# EAGLE design blue-led-2 (EAGLE 9.6.2)
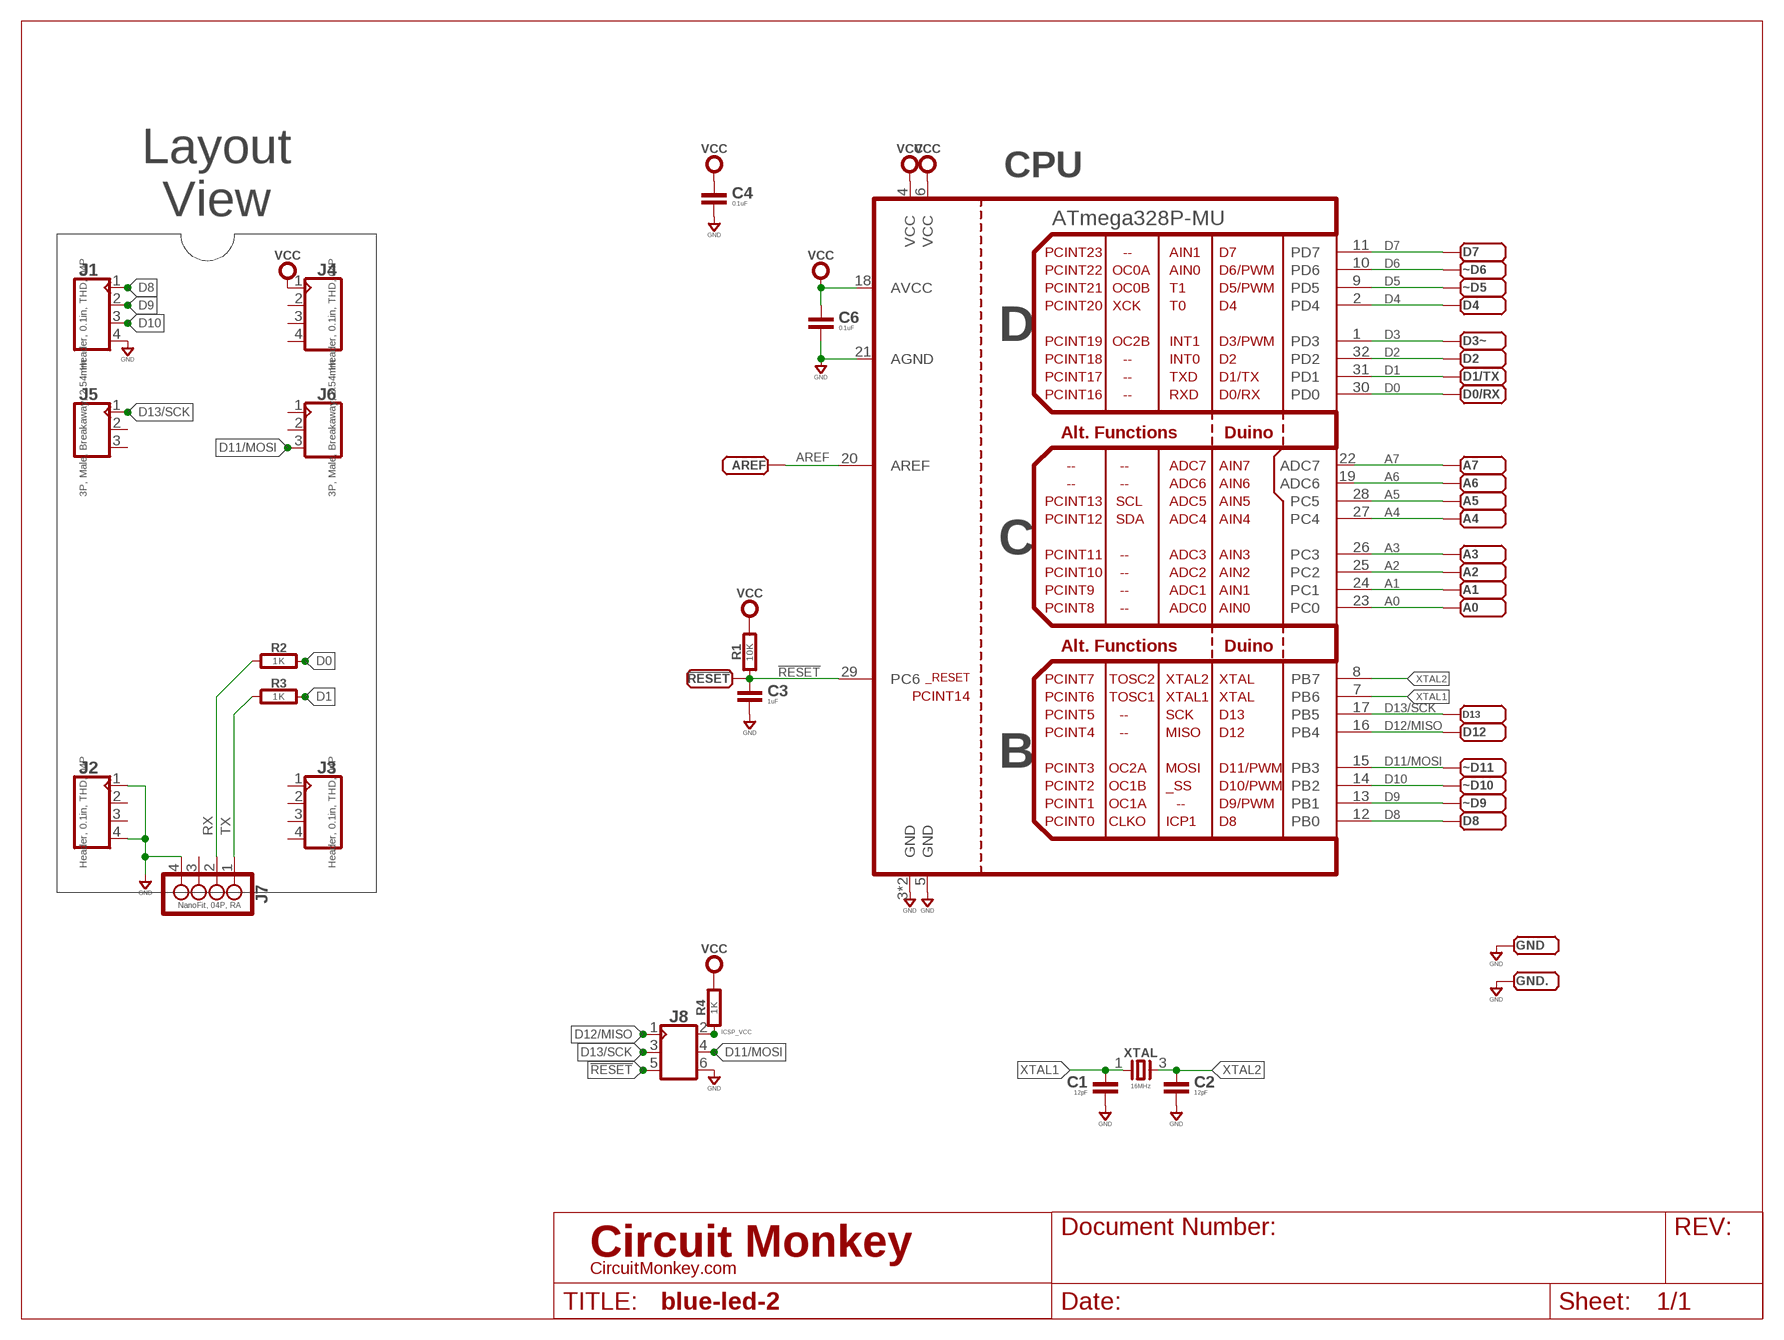
[diagram p0: schematic, sheet 1]

## Parts
!RESET  PADSMD-050X050  [SMD-050X050]
A0  PADSMD-050X050  [SMD-050X050]
A1  PADSMD-050X050  [SMD-050X050]
A2  PADSMD-050X050  [SMD-050X050]
A3  PADSMD-050X050  [SMD-050X050]
A4  PADSMD-050X050  [SMD-050X050]
A5  PADSMD-050X050  [SMD-050X050]
A6  PADSMD-050X050  [SMD-050X050]
A7  PADSMD-050X050  [SMD-050X050]
AREF  PADSMD-050X050  [SMD-050X050]
C1  12pF  CAPACITOR0603  [0603-CAP]
C2  12pF  CAPACITOR0603  [0603-CAP]
C3  1uF  CAPACITOR0603  [0603-CAP]
C4  0.1uF  CAPACITOR0603  [0603-CAP]
C6  0.1uF  CAPACITOR0603  [0603-CAP]
CPU  ATmega328P-MU  ATMEGA328MU  [MLF32]
D0/RX  PADSMD-050X050  [SMD-050X050]
D1/TX  PADSMD-050X050  [SMD-050X050]
D2  PADSMD-050X050  [SMD-050X050]
D3~  PADSMD-050X050  [SMD-050X050]
D4  PADSMD-050X050  [SMD-050X050]
D7  PADSMD-050X050  [SMD-050X050]
D8  PADSMD-050X050  [SMD-050X050]
D12  PADSMD-050X050  [SMD-050X050]
D13  PADSMD-050X050  [SMD-050X050]
GND  PADSMD-050X050  [SMD-050X050]
GND.  PADSMD-050X050  [SMD-050X050]
J1  Header, 0.1in, THD, 04P  CON_04X1-THD-VT  [MA04X1-VT-THD]
J2  Header, 0.1in, THD, 04P  CON_04X1-THD-VT  [MA04X1-VT-THD]
J3  Header, 0.1in, THD, 04P  CON_04X1-THD-VT  [MA04X1-VT-THD]
J4  Header, 0.1in, THD, 04P  CON_04X1-THD-VT  [MA04X1-VT-THD]
J5  3P, Male, Breakaway, 2.54mm  CON_03X1-2.54MM-THD-VT  [MA03X1-VT-THD]
J6  3P, Male, Breakaway, 2.54mm  CON_03X1-2.54MM-THD-VT  [MA03X1-VT-THD]
J7  NanoFit, 04P, RA  NANOFIT-04P-SR-RA  [MOLEX-105313-XX04]
J8  CON_03X2-VT_SMD  [MA03X2-VT-SMD]
R1  10K  RESISTOR0603  [0603-RES]
R2  1K  RESISTOR0603  [0603-RES]
R3  1K  RESISTOR0603  [0603-RES]
R4  1K  RESISTOR0603  [0603-RES]
XTAL  16MHz  2P3.2X2.5  [32X25]
~D5  PADSMD-050X050  [SMD-050X050]
~D6  PADSMD-050X050  [SMD-050X050]
~D9  PADSMD-050X050  [SMD-050X050]
~D10  PADSMD-050X050  [SMD-050X050]
~D11  PADSMD-050X050  [SMD-050X050]

## Nets
!RESET: !RESET.1(PAD) C3.1 CPU.29(PC6) J8.5 R1.1
A0: A0.1(PAD) CPU.23(PC0)
A1: A1.1(PAD) CPU.24(PC1)
A2: A2.1(PAD) CPU.25(PC2)
A3: A3.1(PAD) CPU.26(PC3)
A4: A4.1(PAD) CPU.27(PC4)
A5: A5.1(PAD) CPU.28(PC5)
A6: A6.1(PAD) CPU.19(ADC6)
A7: A7.1(PAD) CPU.22(ADC7)
AREF: AREF.1(PAD) CPU.20(AREF)
D0: CPU.30(PD0) D0/RX.1(PAD) R2.2
D1: CPU.31(PD1) D1/TX.1(PAD) R3.2
D2: CPU.32(PD2) D2.1(PAD)
D3: CPU.1(PD3) D3~.1(PAD)
D4: CPU.2(PD4) D4.1(PAD)
D5: CPU.9(PD5) ~D5.1(PAD)
D6: CPU.10(PD6) ~D6.1(PAD)
D7: CPU.11(PD7) D7.1(PAD)
D8: CPU.12(PB0) D8.1(PAD) J1.1
D9: CPU.13(PB1) J1.2 ~D9.1(PAD)
D10: CPU.14(PB2) J1.3 ~D10.1(PAD)
D11/MOSI: CPU.15(PB3) J6.3 J8.4 ~D11.1(PAD)
D12/MISO: CPU.16(PB4) D12.1(PAD) J8.1
D13/SCK: CPU.17(PB5) D13.1(PAD) J5.1 J8.3
GND: C1.2 C2.2 C3.2 C4.2 C6.2 CPU.3(GND) CPU.5(GND) CPU.21(AGND) CPU.PAD(GND) GND.1(PAD) GND..1(PAD) J1.4 J2.1 J2.4 J7.4 J8.6
ICSP_VCC: J8.2 R4.1
RX: J7.2 R2.1
TX: J7.1 R3.1
VCC: C4.1 C6.1 CPU.4(VCC) CPU.6(VCC) CPU.18(AVCC) J4.1 R1.2 R4.2
XTAL1: C1.1 CPU.7(PB6) XTAL.1
XTAL2: C2.1 CPU.8(PB7) XTAL.3
Unconnected: J2.2 J2.3 J3.1 J3.2 J3.3 J3.4 J4.2 J4.3 J4.4 J5.2 J5.3 J6.1 J6.2 J7.3

## Notes on the sheet
- Layout
  View

## Library data of the parts
!RESET A0 A1-A7 AREF D0/RX D1/TX D2 D3~ D4 D7 D8 D12 D13 GND GND. ~D5 ~D6 ~D9-~D11 = con-testpoints:PAD: Solder Pad
C1-C4 C6 = rlc:CAPACITOR: Capacitor; COST01: 0.12; COST10: 0.09; COST100: 0.05
CPU = atmel-atmega:ATMEGA328: Atmega 328P; MFR: Atmel; MPN: atmega328p-mu; OC_MOUSER: 556-ATMEGA328P-MU; OC_SEEED: 310010005
J1-J4 = con-headers:CON_04X1: Headers, 04 pin; MFR: Molex; MPN: 022284043
J5 J6 = con-headers:CON_03X1: Header, 3-pin, single row
J7 = con-molex:NANOFIT-04P-SR: Molex, Nanofit; COST01: 1.40; COST10: 1.10; COST100: 1.00; MFR: Molex; MPN: 105313-XX04
J8 = con-headers:CON_03X2: Header, 3x2 (6-pin)
R1-R4 = rlc:RESISTOR: Resistor; COST01: 0.10; COST10: 0.05; COST100: 0.02
XTAL = xtal:2P: Crystal; MFR: Epson; MPN: FA-238 16.0000MB-K3

## Board
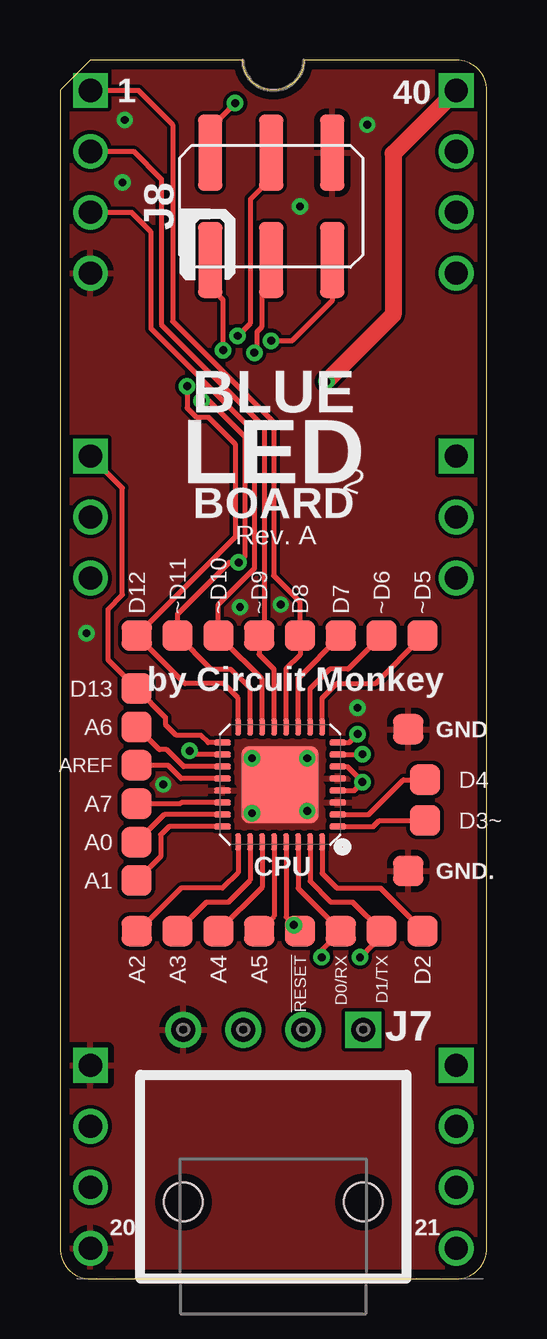
[diagram p1: board, top side]
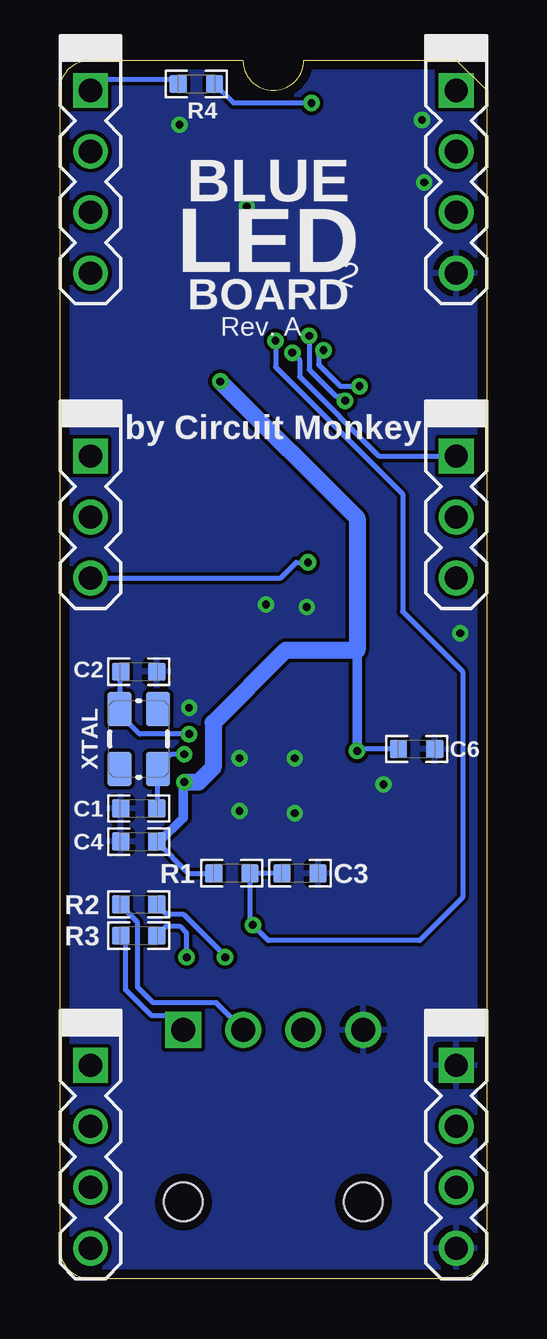
[diagram p2: board, bottom side, seen from below]

Size 17.78 x 50.8 mm. Coordinates in mm from the lower left corner, seen from the top.
Outline: 1.27,0 16.51,0 arc90 17.78,1.27 17.78,49.53 arc90 16.51,50.8 10.16,50.8 arc-90 8.89,49.53 arc-90 7.62,50.8 1.27,50.8 0,49.53 0,1.27 arc90 1.27,0
Copper layers (1*16): Top 0.0356mm / dielectric 1.5011mm / Bottom 0.0356mm
Design rules "OSH-CircuitMonkey *": minimum track width 6mil, minimum drill 12mil, track to track 6mil, track to pad 6mil, pad to pad 6mil, via to via 6mil, smd to smd 6mil, copper to edge 15mil, drill to drill 6mil, minimum pad ring 7mil, minimum via ring 7mil, stop-mask expansion 3mil, vias tented up to drill 13mil, thermal gap 10mil

### Footprints (pad centres in the part's own frame; a part is rotated, then mirrored left to right if it is on the bottom)
SMD-050X050 = smd 1.27 x 1.27: 1 0.508,0
0603-CAP = smd 0.711 x 0.762: 1 -0.752,0; 2 0.752,0
MLF32 = smd 0.7 x 0.25: 1 -2.4,1.75; 2 -2.4,1.25; 3 -2.4,0.75; 4 -2.4,0.25; 5 -2.4,-0.25; 6 -2.4,-0.75; 7 -2.4,-1.25; 8 -2.4,-1.75; 17 2.4,-1.75; 18 2.4,-1.25; 19 2.4,-0.75; 20 2.4,-0.25; 21 2.4,0.25; 22 2.4,0.75; 23 2.4,1.25; 24 2.4,1.75 | smd 0.25 x 0.7: 9 -1.75,-2.4; 10 -1.25,-2.4; 11 -0.75,-2.4; 12 -0.25,-2.4; 13 0.25,-2.4; 14 0.75,-2.4; 15 1.25,-2.4; 16 1.75,-2.4; 25 1.75,2.4; 26 1.25,2.4; 27 0.75,2.4; 28 0.25,2.4; 29 -0.25,2.4; 30 -0.75,2.4; 31 -1.25,2.4; 32 -1.75,2.4 | smd 3.2 x 3.2: PAD 0,0
MA04X1-VT-THD = drill 0.965 square: 1 -3.81,0 | drill 0.965: 2 -1.27,0; 3 1.27,0; 4 3.81,0
MA03X1-VT-THD = drill 0.965 square: 1 -2.54,0 | drill 0.965: 2 0,0; 3 2.54,0
MOLEX-105313-XX04 = drill 1 square: 1 7.18,-3.75 | drill 1: 2 7.18,-1.25; 3 7.18,1.25; 4 7.18,3.75 | hole 1.6: 0,-3.75; 0,3.75
MA03X2-VT-SMD = smd 1.016 x 3.175: 1 -2.54,-2.235; 2 -2.54,2.235; 3 0,-2.235; 4 0,2.235; 5 2.54,-2.235; 6 2.54,2.235
0603-RES = smd 0.711 x 0.762: 1 -0.752,0; 2 0.752,0
32X25 = smd 1.4 x 1: 1 -1.25,-0.8; 2 1.25,-0.8; 3 1.25,0.8; 4 -1.25,0.8

### Placement (x,y rotation side)
!RESET  10,15 270 top
A0  3.7,18.2 180 top
A1  3.7,16.6 180 top
A2  3.2,15 270 top
A3  4.9,15 270 top
A4  6.6,15 270 top
A5  8.3,15 270 top
A6  3.7,23 180 top
A7  3.7,19.8 180 top
AREF  3.7,21.4 180 top
C1  14.5,19.6 180 bottom
C2  14.5,25.3 0 bottom
C3  7.78,16.9 0 bottom
C4  14.5,18.22 180 bottom
C6  2.92,22.08 0 bottom
CPU  9.17,20.6 180 top
D0/RX  11.7,15 270 top
D1/TX  13.4,15 270 top
D2  15.1,15 270 top
D3~  14.7,19.1 0 top
D4  14.7,20.8 0 top
D7  11.7,26.3 90 top
D8  10,26.3 90 top
D12  3.2,26.3 90 top
D13  3.7,24.6 180 top
GND  14,22.9 0 top
GND.  14,17 0 top
J1  1.27,45.72 270 bottom
J2  1.27,5.08 270 bottom
J3  16.51,5.08 270 bottom
J4  16.51,45.72 270 bottom
J5  1.27,31.75 270 bottom
J6  16.51,31.75 270 bottom
J7  8.89,3.2 90 top
J8  8.8,44.7 0 top
R1  10.62,16.9 180 bottom
R2  14.5,15.6 0 bottom
R3  14.5,14.3 0 bottom
R4  12.1,49.8 180 bottom
XTAL  14.5,22.5 90 bottom
~D5  15.1,26.3 90 top
~D6  13.4,26.3 90 top
~D9  8.3,26.3 90 top
~D10  6.6,26.3 90 top
~D11  4.9,26.3 90 top

### Tracks (layer width: path | path; a pad name or v marks a point on that pad's centre or on a via)
!RESET  (via drill 0.33)
  Top 0.2: CPU.29 9.42,15.07 v9.75,14.75 !RESET.1 | J8.5 11.34,40.77 9.68,39.1 v8.8,39.1
  Bottom 0.2: v8.8,39.1 8.8,38 3.5,32.7 3.5,27.8 1,25.3 1,15.9 2.8,14.1 9.1,14.1 v9.75,14.75 9.87,14.87 R1.1 C3.1
A0
  Top 0.2: CPU.23 4.35,19.35 A0.1
A1
  Top 0.2: CPU.24 4.54,18.85 4.19,18.5 4.19,17.6 A1.1
A2
  Top 0.2: CPU.25 7.42,16.92 6.78,16.28 5.05,16.28 3.26,14.49 A2.1
A3
  Top 0.2: A3.1 6.1,15.69 7.01,15.69 7.92,16.61 CPU.26
A4
  Top 0.2: CPU.27 8.42,16.31 A4.1
A5
  Top 0.2: CPU.28 8.92,15.11 A5.1
A6
  Top 0.2: A6.1 4.14,22.05 4.45,22.05 5.15,21.35 CPU.19
A7
  Top 0.2: CPU.22 5.05,19.85 5,19.8 A7.1
AREF
  Top 0.2: CPU.20 5.05,20.85 4.5,21.4 AREF.1
D0  (via drill 0.33)
  Top 0.2: CPU.30 9.92,16.27 D0/RX.1 10.9,13.69 v10.9,13.4
  Bottom 0.2: v10.9,13.4 10.9,13.45 12.65,15.2 13.35,15.2 R2.2
D1  (via drill 0.33)
  Top 0.2: CPU.31 10.42,16.57 11.3,15.69 12.2,15.69 D1/TX.1 13.4,14.3 v12.5,13.4
  Bottom 0.2: v12.5,13.4 12.5,14.4 12.8,14.7 13.35,14.7 R3.2
D2
  Top 0.2: CPU.32 10.92,16.9 11.54,16.28 13.35,16.28 15.1,14.53 D2.1
D3
  Top 0.2: CPU.1 13.06,18.85 13.31,19.1 D3~.1
D4
  Top 0.2: CPU.2 12.86,19.35 14.31,20.8 D4.1
D5
  Top 0.2: CPU.9 10.92,24.2 11.54,24.82 13.15,24.82 15.1,26.77 ~D5.1
D6
  Top 0.2: CPU.10 10.42,24.59 11.23,25.41 12,25.41 ~D6.1
D7
  Top 0.2: CPU.11 9.92,25.03 D7.1
D8
  Top 0.2: CPU.12 9.42,25.43 10,26.01 D8.1 10,28.21 8.9,29.31 8.9,35.7 4.69,39.91 4.69,48.11 3.27,49.53 J1.1
D9
  Top 0.2: CPU.13 8.92,25.4 8.3,26.02 ~D9.1 8.5,27.01 8.5,35.5 4.23,39.77 4.23,45.83 3.07,46.99 J1.2
D10
  Top 0.2: CPU.14 8.42,25 6.81,26.61 6.8,26.61 ~D10.1 6.6,28.11 8.1,29.61 8.1,35.3 3.79,39.61 3.79,43.63 2.97,44.45 J1.3
D11/MOSI  (via drill 0.33)
  Top 0.2: CPU.15 7.92,24.59 7.11,25.4 6.31,25.4 ~D11.1 4.9,27.71 7.05,29.85 v7.45,29.85 7.7,30.11 7.7,35.1 6.2,36.6 v5.9,36.6 | J8.4 8.8,45.87 7.94,45.01 7.94,39.84 v7.4,39.3
  Bottom 0.2: v7.4,39.3 7.4,37.9 6.3,36.8 6.1,36.8 v5.9,36.6 | J6.3 8.59,29.21 7.95,29.85 v7.45,29.85
D12/MISO  (via drill 0.33)
  Top 0.2: CPU.16 7.42,24.2 6.82,24.8 5.21,24.8 D12.1 7.3,30.91 7.3,34.8 6.2,35.9 5.7,35.9 5.3,36.3 v5.3,37.2 | v6.8,38.7 6.8,40.8 6.26,41.34 J8.1 | J8.1
  Bottom 0.2: v6.8,38.7 7,38.5 7,38.1 6.1,37.2 v5.3,37.2
D13/SCK  (via drill 0.33)
  Top 0.2: CPU.17 6.17,22.35 5.87,22.65 4.85,22.65 4.39,23.11 4.39,23.4 D13.1 2,25.79 2,27.9 2.6,28.5 2.6,32.96 J5.1 | J8.3 8.4,42.06 8.4,39.66 8.2,39.47 8.2,38.7 v8.1,38.6
  Bottom 0.2: v8.1,38.6 7.8,38.3 7.8,37.6 4.49,34.29 J5.1
GND  (via drill 0.32)
  other vias: 8,19.4 8,21.7 10.3,19.5 10.3,21.7 12.4,23.8 4.3,20.6 1.1,26.9 2.7,48.3 2.6,45.7 12.8,48.1 10,44.7 9.2,28.1 7.5,28
  pour Top: 0,0 0,50.8 17.78,50.8 17.78,0
  pour Bottom: 0,0 0,50.8 17.78,50.8 17.78,0
ICSP_VCC  (via drill 0.33)
  Top 0.2: J8.2 6.26,47.96 v7.3,49
  Bottom 0.2: v7.3,49 10.55,49 R4.1
RX
  Bottom 0.2: J7.2 11.26,11.5 13.9,11.5 14.54,12.14 14.54,14.84 15.25,15.55 R2.1
TX
  Bottom 0.2: J7.1 13.24,10.98 13.98,10.98 15.05,12.05 15.05,14.1 R3.1
VCC  (via drill 0.33)
  Top 0.2: CPU.18 5.55,21.85 v5.4,22 | CPU.6 11.97,21.35 12.62,20.7 v12.6,20.7 12.6,20.68 12.27,20.35 CPU.4
  Top 0.7: v11.1,37.4 13.88,40.18 13.88,46.9 J4.1
  Bottom 0.2: C6.1 5.32,22.08 v5.4,22 | C4.1 12.43,16.9 R1.2 | R4.2 13.05,50 16.04,50 J4.1
  Bottom 0.4: v12.6,20.7 12.64,20.66 12.64,19.21 13.63,18.22 C4.1 | v5.4,22 5.4,26.2
  Bottom 0.7: v12.6,20.7 12,20.7 11.4,21.3 11.4,23.17 8.37,26.2 5.4,26.2 5.4,31.7 v11.1,37.4
XTAL1  (via drill 0.33)
  Top 0.2: CPU.7 v12.6,21.85 v12.6,21.86
  Bottom 0.2: C1.1 13.7,19.65 XTAL.1 13.7,21.35 13.19,21.86 v12.6,21.86
XTAL2  (via drill 0.33)
  Top 0.2: CPU.8 12.05,22.35 v12.4,22.7
  Bottom 0.2: C2.1 15.3,25.25 XTAL.3 15.3,23.55 14.45,22.7 v12.4,22.7

### Text on the board
tPlace: 1 | 40 | BLUE | LED | BOARD | 2 | Rev. A | by Circuit Monkey | 20 | 21
bPlace: BLUE | LED | BOARD | 2 | Rev. A | by Circuit Monkey